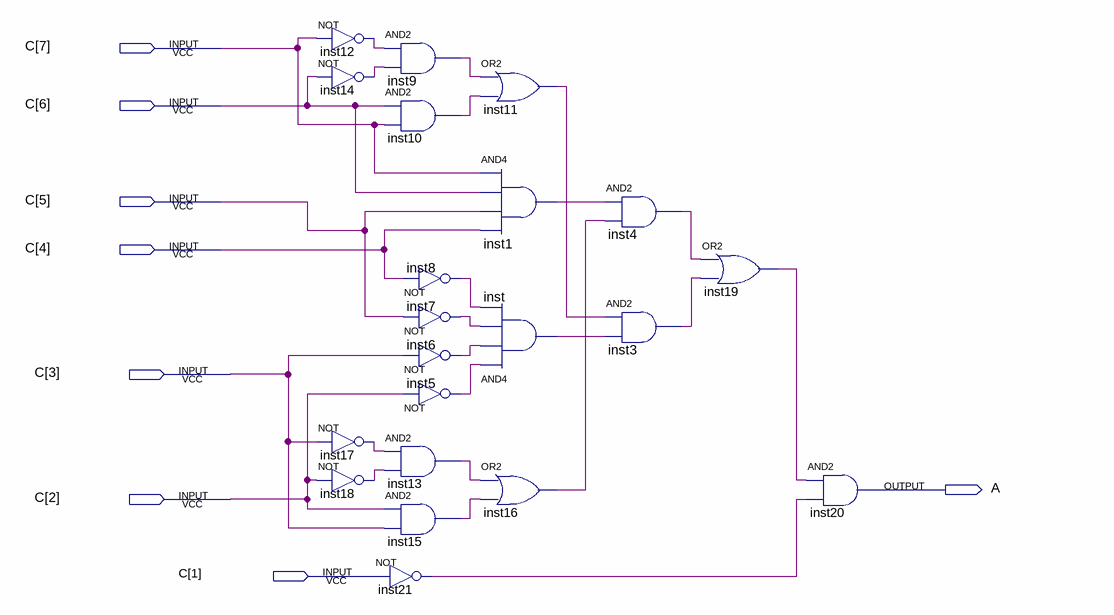
[diagram p0: schematic sheet]
// Quartus schematic cdp_a.bdf as structural Verilog: 21 symbols, 8 pins
module cdp_a (
  input  [7:1] C,
  output A
);

  wire inst1_out, inst3_out, inst4_out, inst5_out, inst6_out, inst7_out, inst8_out, inst9_out, inst10_out,
       inst11_out, inst12_out, inst13_out, inst14_out, inst15_out, inst16_out, inst17_out, inst18_out,
       inst19_out, inst21_out, inst_out;

  not inst12 (inst12_out, C[7]);
  not inst14 (inst14_out, C[6]);
  not inst17 (inst17_out, C[3]);
  not inst18 (inst18_out, C[2]);
  and inst9 (inst9_out, inst12_out, inst14_out);
  and inst10 (inst10_out, C[6], C[7]);
  not inst8 (inst8_out, C[4]);
  not inst7 (inst7_out, C[5]);
  not inst6 (inst6_out, C[3]);
  not inst5 (inst5_out, C[2]);
  and inst13 (inst13_out, inst17_out, inst18_out);
  and inst15 (inst15_out, C[2], C[3]);
  not inst21 (inst21_out, C[1]);
  or inst11 (inst11_out, inst9_out, inst10_out);
  and inst1 (inst1_out, C[7], C[6], C[5], C[4]);
  and inst (inst_out, inst5_out, inst6_out, inst7_out, inst8_out);
  or inst16 (inst16_out, inst13_out, inst15_out);
  and inst4 (inst4_out, inst1_out, inst16_out);
  and inst3 (inst3_out, inst11_out, inst_out);
  or inst19 (inst19_out, inst4_out, inst3_out);
  and inst20 (A, inst19_out, inst21_out);
endmodule
